# Altium schematic sheet comunicacao.SchDoc
size A4
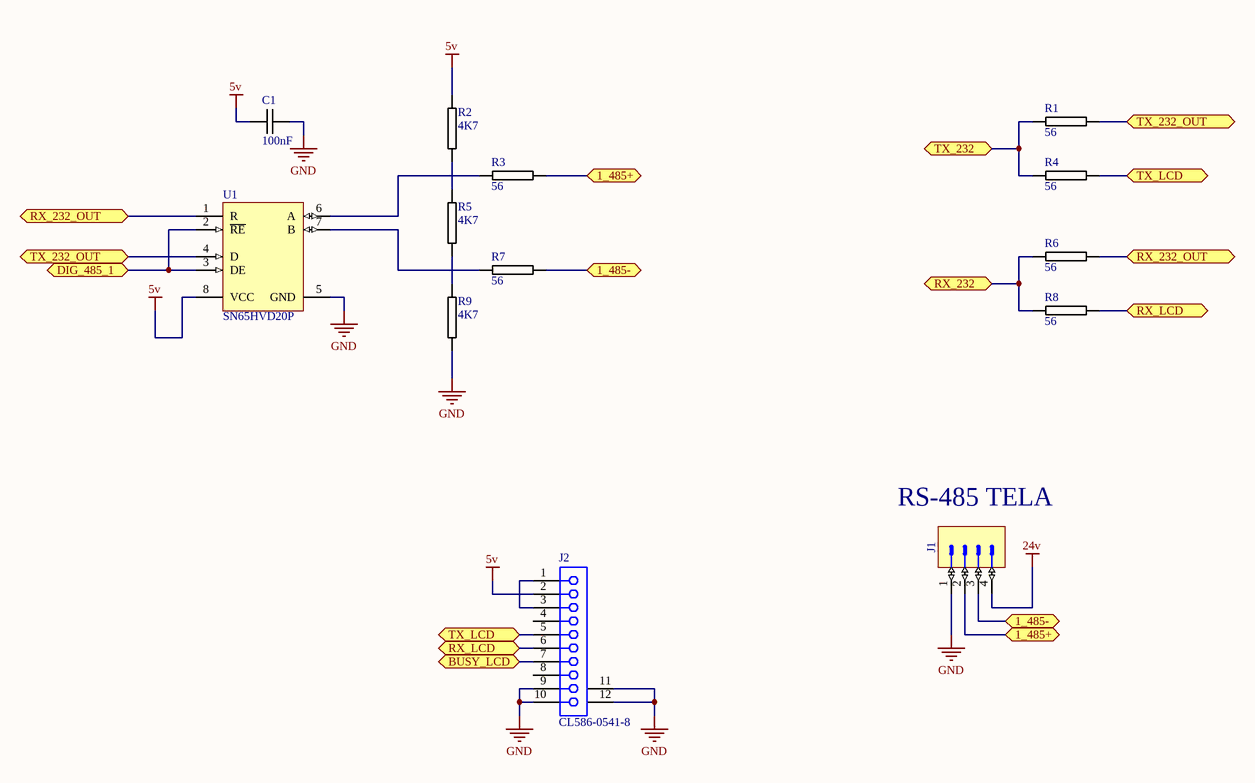
[diagram p0: comunicacao.SchDoc]

## Parts
C1  100nF  [0805C-TBD]
J1  (no value)  [PHOENIX_1757268]
J2  CL586-0541-8  [FH12-22(10)SA-1SH]
R1  56  [0805R-56]
R2  4K7  [0805R-4K7]
R3  56  [0805R-56]
R4  56  [0805R-56]
R5  4K7  [0805R-4K7]
R6  56  [0805R-56]
R7  56  [0805R-56]
R8  56  [0805R-56]
R9  4K7  [0805R-4K7]
U1  SN65HVD20P  [P8]

## Ports
1_485+, 1_485-, BUSY_LCD, DIG_485_1 (bidir), RX_232, RX_232_OUT, RX_LCD, TX_232, TX_232_OUT, TX_LCD

## Nets
5v: C1.1 J2.2 R2.1 U1.8(VCC)
24v: J1.4
GND: C1.2 J1.1 J2.9 J2.10 J2.11(MH1) J2.12(MH2) R9.2 U1.5(GND)
1_485+: J1.2 R3.2 ; port 1_485+
1_485-: J1.3 R7.2 ; port 1_485-
BUSY_LCD: J2.7 ; port BUSY_LCD
DIG_485_1: U1.2(~{RE}) U1.3(DE) ; port DIG_485_1
RX_232: R6.1 R8.1 ; port RX_232
RX_232_OUT: R6.2 U1.1(R) ; port RX_232_OUT
RX_LCD: J2.6 R8.2 ; port RX_LCD
TX_232: R1.1 R4.1 ; port TX_232
TX_232_OUT: R1.2 U1.4(D) ; port TX_232_OUT
TX_LCD: J2.5 R4.2 ; port TX_LCD
NetJ2_1: J2.1 J2.3
NetR2_2: R2.2 R5.1
NetR3_1: R3.1 U1.6(A)
NetR5_2: R5.2 R9.1
NetR7_1: R7.1 U1.7(B)

Not connected (* = marked no-connect by the designer): J2 4 8

## Notes on the sheet
- RS-485 TELA

## Library data of the parts
C1 = 0805C-100nF-25V-X7R-MUR: CAPACITOR 0805 CERAMIC; Supplier 1: Digi-Key; Supplier Part Number 1: 490-1673-1-ND
J1 = PHOENIX_1757268: Connector 4 Male; Part Description: 12A, 250V, Pitch 5.08mm, 4 Positions Header; Manufacturer: PHOENIX CONTACT; Manufacturer Part Number: 1757268 (MSTBA 2,5/ 4-G-5,08); Part Number: PHOENIX_1757268; Component Kind: Standard; Component Type: Standard; Pin Count: 4; Mounted: Yes; Socket: No; SMD: No; Status: None; ComponentHeight: 8.6mm; HelpURL: \\cern.ch\dfs\Applications\Altium\Datasheets\PHOENIX_1757268.pdf; Author: CERN DEM JLC; CreateDate: 10/02/2010; LatestRevisionDate: 26/04/2010; Table: PHOENIX
J2 = CL586-0541-8: FH12 Series, "Flip-Lock" SMT/ZIF FFC/FPC Connector - 1.0mm Spaced Bottom Eccentric Contact; Positions: 10; ContactMaterial: Phosphor Bronze; Current: 0.5A; PCB_Layout: Complies with manufacturer's recommendation.; Note: Pad dimensions follow nominal values, Suitable for Wave Soldering, Adjust for Re-flow.; Published: 17-Jul-2002; DatasheetVersion: 13-Nov-2000; PackageVersion: 13-Nov-2000; PackageReference: FH12-22(10)SA-1SH; Publisher: Altium Limited; ComponentLink1Description: Manufacturer Link; ComponentLink1URL: http://www.hiroseusa.com/; ComponentLink2Description: Datasheet; ComponentLink2URL: http://www.hirose.co.jp/cataloge_hp/e58605370.pdf
R1 R3 R4 R6-R8 = 0805R-56: RESISTOR 0805 1/4 WATT THIN FILM; Reel: *
R2 R5 R9 = 0805R-4K7: RESISTOR 0805 1/4 WATT THIN FILM; Reel: *
U1 = SN65HVD20P: Extended Common-mode RS-485 Transceiver, 25 Mbps, 5 V, Half Duplex, -40 to 85 degC, 8-pin PDIP (P), Pb-Free (RoHS); Manufacturer: Texas Instruments; Eco-Plan: Green (RoHS & no Sb/Br); # of TX/RX: 1 TX / 1 RX; Drivers Per Package: 1; Isolated: No; Number of Nodes: 64; Signaling Rate(Mbps): 25; Common Mode Range: -20 to 25; ESD(kV): 16; Fault Protection(V): -27 to 27; Fail Safe: Idle, Open, Short; ICC(Max)(mA): 9; Supply Voltage(s)(V): 5; Rating: Catalog; DatasheetVersion: SLLS552E; PackageVersion: revE, Apr-2010; PackageReference: P8; PackageDescription: 8-Pin Plastic Dual-In-Line Package, Row Spacing 7.62 mm, Pitch 2.54 mm; Supplier 1: Digi-Key; Supplier Part Number 1: SN65HVD20P-ND; Supplier 2: Mouser; Supplier Part Number 2: 595-SN65HVD20P; SubFamily: RS-485; Receivers Per Package: 1; Duplex: Half; Footprint: SN75176; Mounting Technology: Through-hole; PartNumber: SN65HVD20P; Code_JEDEC: MS-001-BA; ComponentLink1Description: Datasheet; ComponentLink1URL: http://www.ti.com/general/docs/lit/getliterature.tsp?genericPartNumber=SN65HVD20&fileType=pdf; ComponentLink2Description: Package Specification; ComponentLink2URL: http://www.ti.com/litv/pdf/mpdi001b